# EAGLE design cpc_exp_breakout (EAGLE 9.6.2)
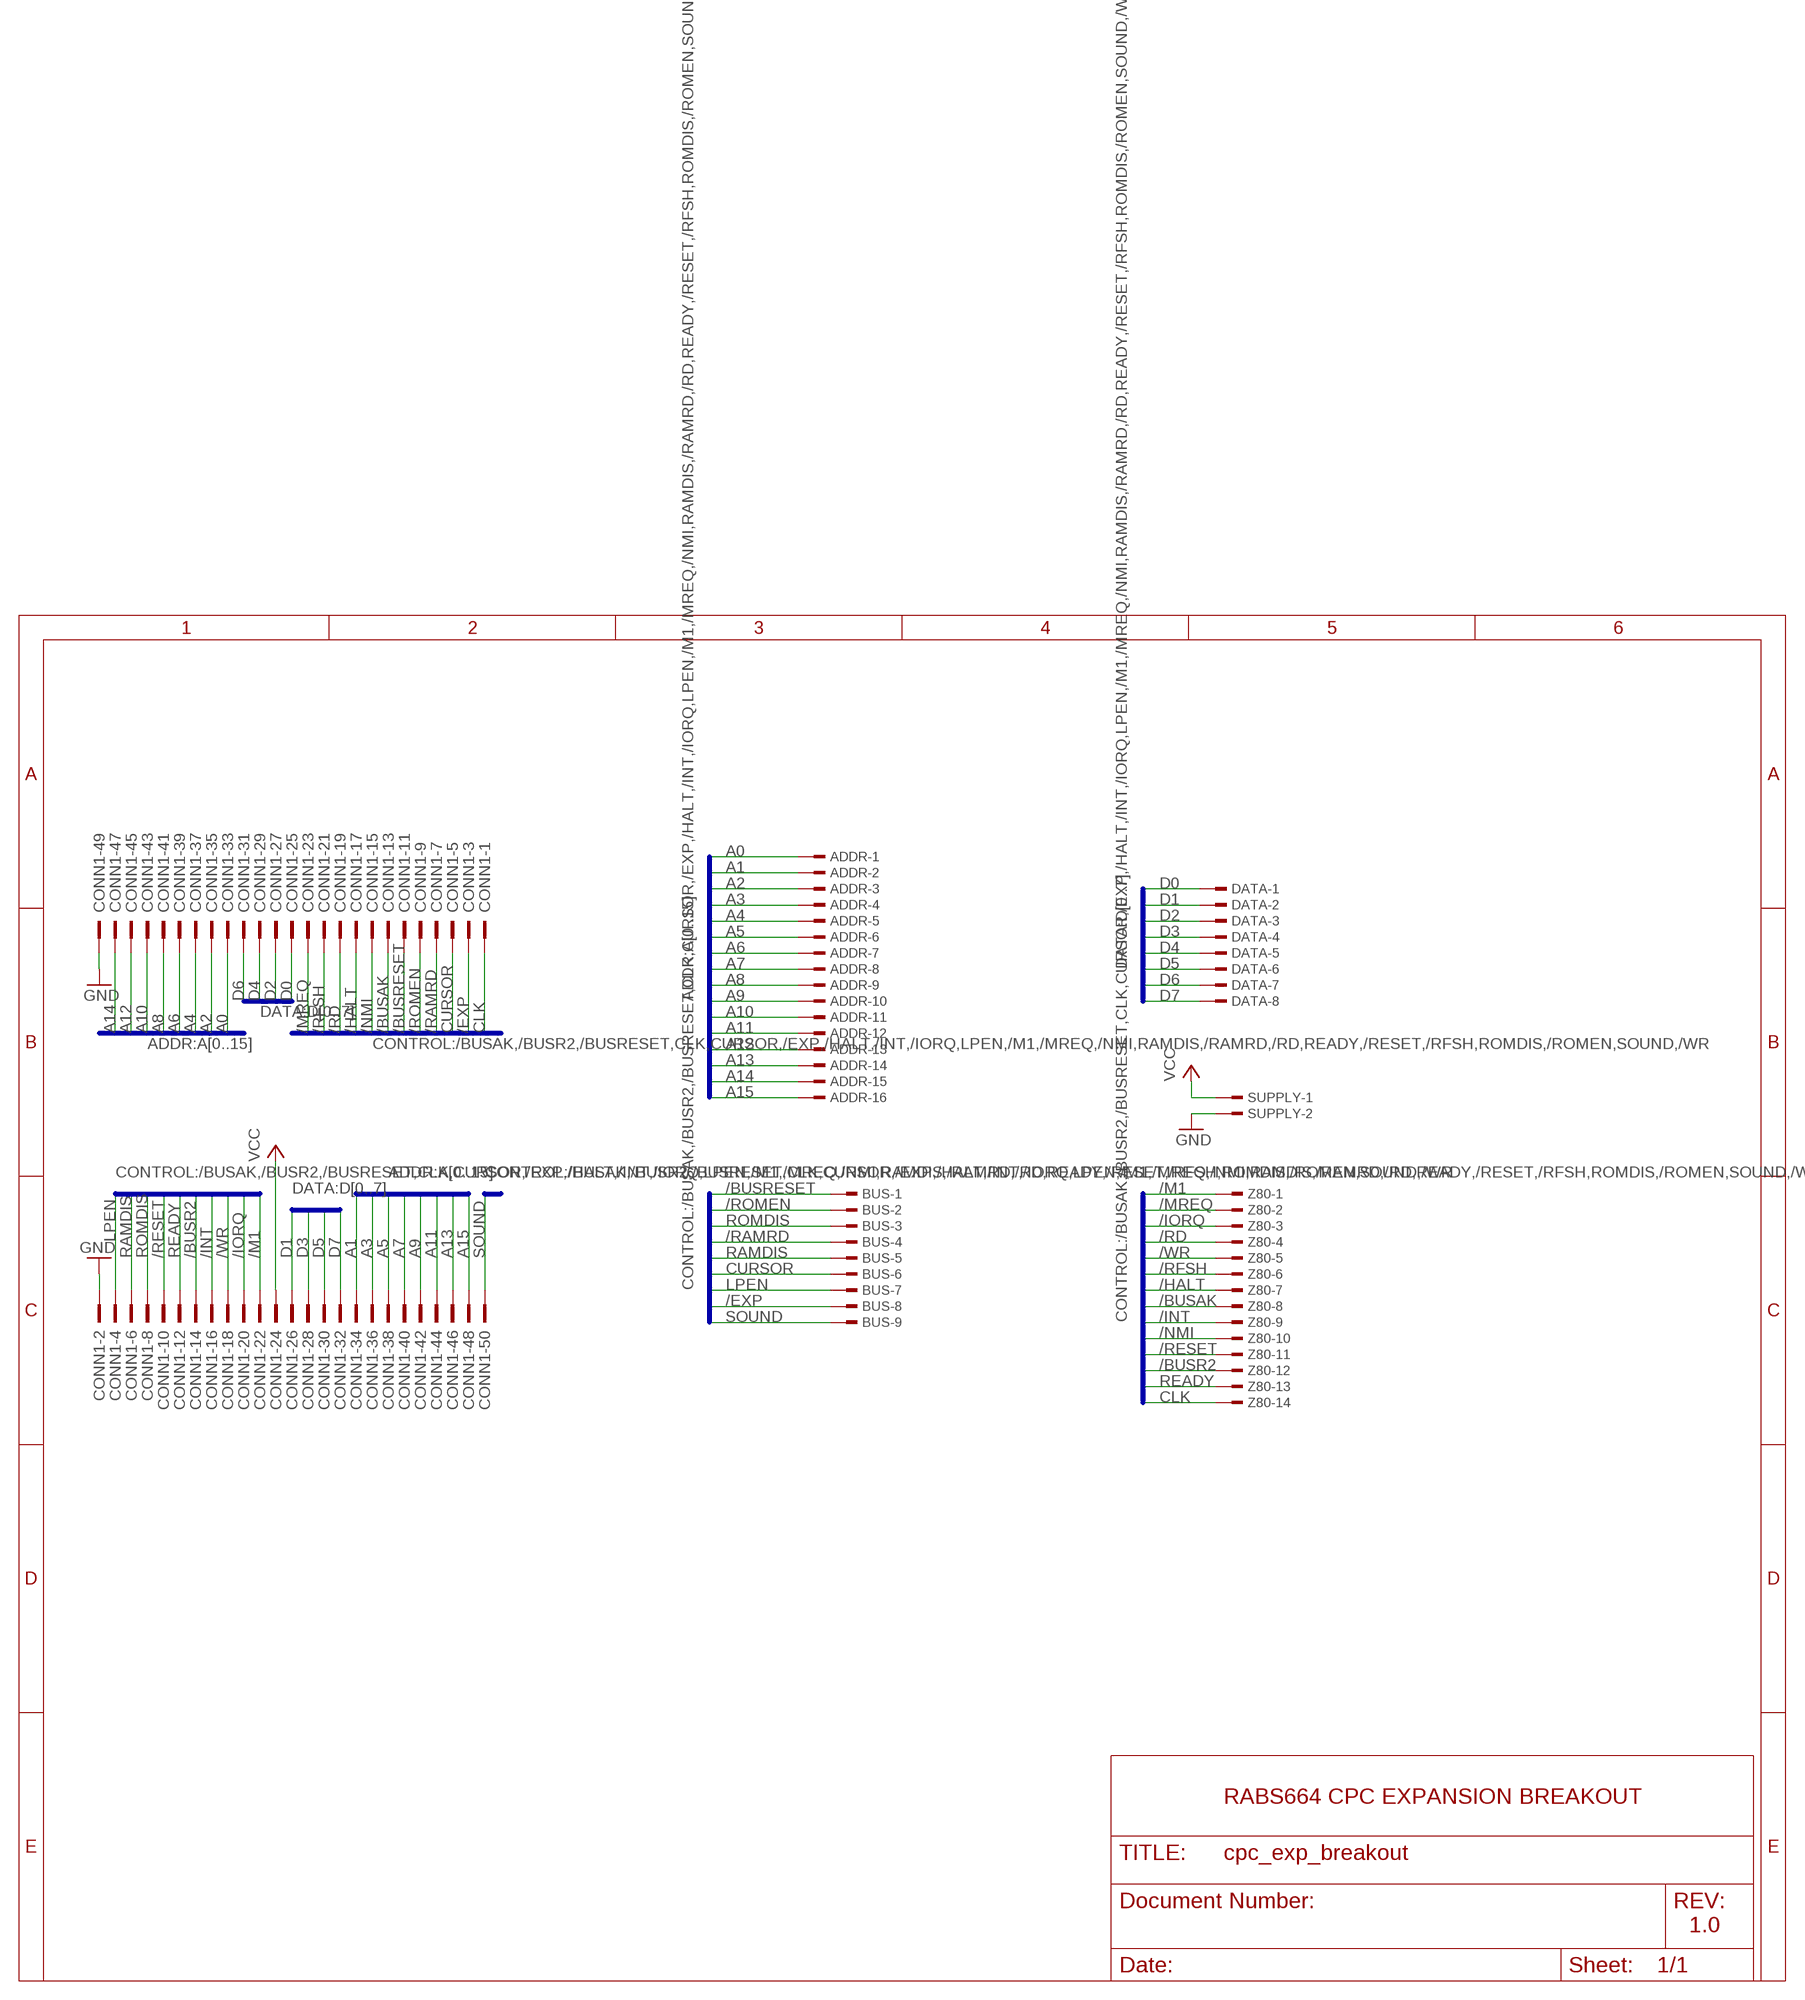
[diagram p0: schematic, sheet 1]

## Parts
ADDR  TSW-116-07-G-S  [TSW-116-XX-G-S]
BUS  TSW-109-07-G-S  [TSW-109-XX-G-S]
CONN1  2550-  [PAK100/2500-50]
DATA  TSW-108-07-G-S  [TSW-108-XX-G-S]
SUPPLY  TSW-102-07-G-S  [TSW-102-XX-G-S]
Z80  TSW-114-07-G-S  [TSW-114-XX-G-S]

## Nets
/BUSAK: CONN1.13 Z80.8
/BUSR2: CONN1.14 Z80.12
/BUSRESET: BUS.1 CONN1.11
/EXP: BUS.8 CONN1.3
/HALT: CONN1.17 Z80.7
/INT: CONN1.16 Z80.9
/IORQ: CONN1.20 Z80.3
/M1: CONN1.22 Z80.1
/MREQ: CONN1.23 Z80.2
/NMI: CONN1.15 Z80.10
/RAMRD: BUS.4 CONN1.7
/RD: CONN1.19 Z80.4
/RESET: CONN1.10 Z80.11
/RFSH: CONN1.21 Z80.6
/ROMEN: BUS.2 CONN1.9
/WR: CONN1.18 Z80.5
A0: ADDR.1 CONN1.33
A1: ADDR.2 CONN1.34
A2: ADDR.3 CONN1.35
A3: ADDR.4 CONN1.36
A4: ADDR.5 CONN1.37
A5: ADDR.6 CONN1.38
A6: ADDR.7 CONN1.39
A7: ADDR.8 CONN1.40
A8: ADDR.9 CONN1.41
A9: ADDR.10 CONN1.42
A10: ADDR.11 CONN1.43
A11: ADDR.12 CONN1.44
A12: ADDR.13 CONN1.45
A13: ADDR.14 CONN1.46
A14: ADDR.15 CONN1.47
A15: ADDR.16 CONN1.48
CLK: CONN1.1 Z80.14
CURSOR: BUS.6 CONN1.5
D0: CONN1.25 DATA.1
D1: CONN1.26 DATA.2
D2: CONN1.27 DATA.3
D3: CONN1.28 DATA.4
D4: CONN1.29 DATA.5
D5: CONN1.30 DATA.6
D6: CONN1.31 DATA.7
D7: CONN1.32 DATA.8
GND [supply]: CONN1.2 CONN1.49 SUPPLY.2
LPEN: BUS.7 CONN1.4
RAMDIS: BUS.5 CONN1.6
READY: CONN1.12 Z80.13
ROMDIS: BUS.3 CONN1.8
SOUND: BUS.9 CONN1.50
VCC [supply]: CONN1.24 SUPPLY.1

## Buses
ADDR:A[0..15]
DATA:D[0..7]
CONTROL:/BUSAK,/BUSR2,/BUSRESET,CLK,CURSOR,/EXP,/HALT,/INT,/IORQ,LPEN,/M1,/MREQ,/NMI,RAMDIS,/RAMRD,/RD,READY,/RESET,/RFSH,ROMDIS,/ROMEN,SOUND,/WR

## Notes on the sheet
- RABS664 CPC EXPANSION BREAKOUT
- 1.0

## Library data of the parts
ADDR = con-samtec:TSW-116-*-G-S: THROUGH-HOLE .025" SQ POST HEADER Source: Samtec TSW.pdf; MF: Samtec Inc.; MPN: TSW-116-07-G-S
BUS = con-samtec:TSW-109-*-G-S: THROUGH-HOLE .025" SQ POST HEADER Source: Samtec TSW.pdf; MF: Samtec Inc.; MPN: TSW-109-07-G-S
CONN1 = con-3m:2550-: 3M (TM) Pak 100 4-Wall Header Source: 3M; OC_FARNELL: unknown; OC_NEWARK: unknown; SPICEPREFIX: X
DATA = con-samtec:TSW-108-*-G-S: THROUGH-HOLE .025" SQ POST HEADER Source: Samtec TSW.pdf; MF: Samtec Inc.; MPN: TSW-108-07-G-S
SUPPLY = con-samtec:TSW-102-*-G-S: THROUGH-HOLE .025" SQ POST HEADER Source: Samtec TSW.pdf; MF: Samtec Inc.; MPN: TSW-102-07-G-S
Z80 = con-samtec:TSW-114-*-G-S: THROUGH-HOLE .025" SQ POST HEADER Source: Samtec TSW.pdf; MF: Samtec Inc.; MPN: TSW-114-07-G-S

## Net classes
0 default: width 0.254 mm, clearance 0.254 mm
1 supply: width 0.508 mm, clearance 0.508 mm

## Board
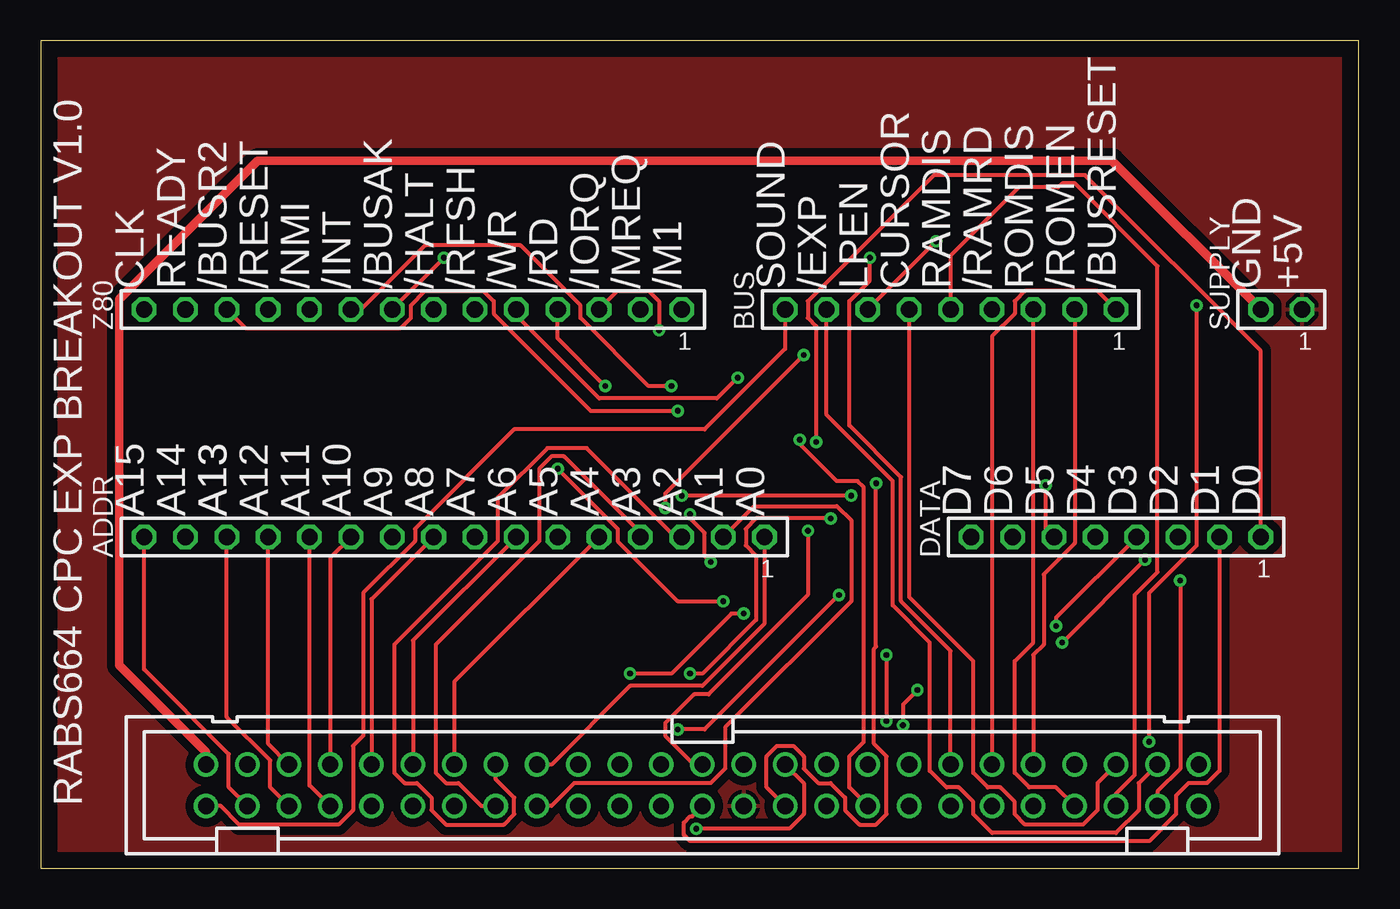
[diagram p1: board, top side]
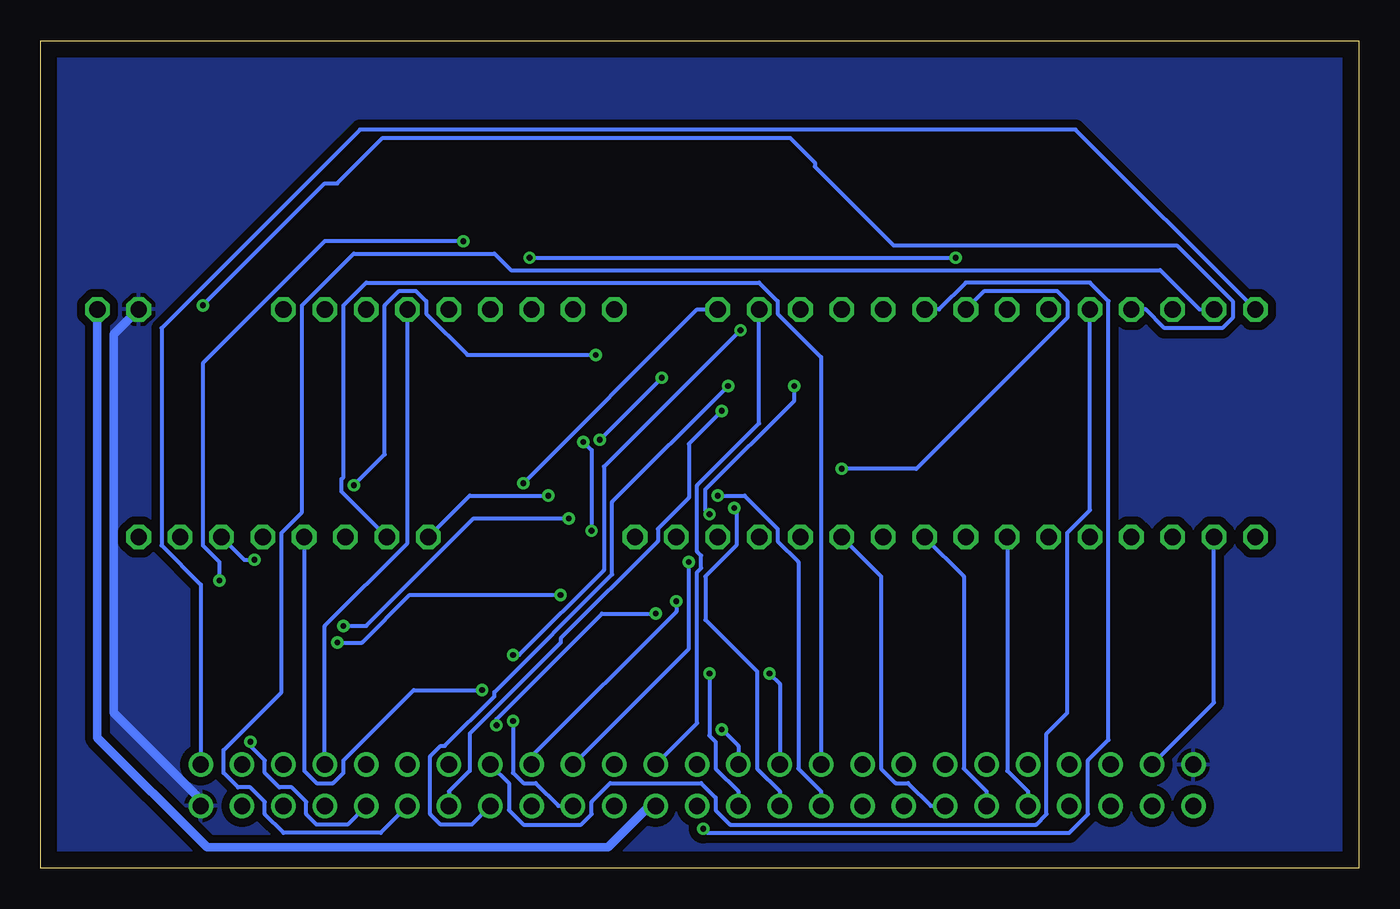
[diagram p2: board, bottom side, seen from below]

Size 80.95 x 50.79 mm. Coordinates in mm from the lower left corner, seen from the top.
Outline: 0,0 80.95,0 80.95,50.79 0,50.79 0,0
Copper layers (1*16): Top 0.035mm / dielectric 1.5mm / Bottom 0.035mm
Design rules "default": minimum track width 6mil, minimum drill 0.35mm, track to track 6mil, track to pad 6mil, pad to pad 6mil, via to via 6mil, smd to smd 6mil, copper to edge 40mil, drill to drill 6mil, minimum pad ring 10mil, minimum via ring 8mil, stop-mask expansion 4mil, vias tented up to drill 0mil, thermal gap 10mil

### Footprints (pad centres in the part's own frame; a part is rotated, then mirrored left to right if it is on the bottom)
TSW-116-XX-G-S = drill 1 pad 1.5 octagon: 1 19.05,0; 2 16.51,0; 3 13.97,0; 4 11.43,0; 5 8.89,0; 6 6.35,0; 7 3.81,0; 8 1.27,0; 9 -1.27,0; 10 -3.81,0; 11 -6.35,0; 12 -8.89,0; 13 -11.43,0; 14 -13.97,0; 15 -16.51,0; 16 -19.05,0
TSW-109-XX-G-S = drill 1 pad 1.5 octagon: 1 10.16,0; 2 7.62,0; 3 5.08,0; 4 2.54,0; 5 0,0; 6 -2.54,0; 7 -5.08,0; 8 -7.62,0; 9 -10.16,0
PAK100/2500-50 = drill 1 pad 1.422: 1 -30.48,-1.27; 2 -30.48,1.27; 3 -27.94,-1.27; 4 -27.94,1.27; 5 -25.4,-1.27; 6 -25.4,1.27; 7 -22.86,-1.27; 8 -22.86,1.27; 9 -20.32,-1.27; 10 -20.32,1.27; 11 -17.78,-1.27; 12 -17.78,1.27; 13 -15.24,-1.27; 14 -15.24,1.27; 15 -12.7,-1.27; 16 -12.7,1.27; 17 -10.16,-1.27; 18 -10.16,1.27; 19 -7.62,-1.27; 20 -7.62,1.27; 21 -5.08,-1.27; 22 -5.08,1.27; 23 -2.54,-1.27; 24 -2.54,1.27; 25 0,-1.27; 26 0,1.27; 27 2.54,-1.27; 28 2.54,1.27; 29 5.08,-1.27; 30 5.08,1.27; 31 7.62,-1.27; 32 7.62,1.27; 33 10.16,-1.27; 34 10.16,1.27; 35 12.7,-1.27; 36 12.7,1.27; 37 15.24,-1.27; 38 15.24,1.27; 39 17.78,-1.27; 40 17.78,1.27; 41 20.32,-1.27; 42 20.32,1.27; 43 22.86,-1.27; 44 22.86,1.27; 45 25.4,-1.27; 46 25.4,1.27; 47 27.94,-1.27; 48 27.94,1.27; 49 30.48,-1.27; 50 30.48,1.27
TSW-108-XX-G-S = drill 1 pad 1.5 octagon: 1 8.89,0; 2 6.35,0; 3 3.81,0; 4 1.27,0; 5 -1.27,0; 6 -3.81,0; 7 -6.35,0; 8 -8.89,0
TSW-102-XX-G-S = drill 1 pad 1.5 octagon: 1 1.27,0; 2 -1.27,0
TSW-114-XX-G-S = drill 1 pad 1.5 octagon: 1 16.51,0; 2 13.97,0; 3 11.43,0; 4 8.89,0; 5 6.35,0; 6 3.81,0; 7 1.27,0; 8 -1.27,0; 9 -3.81,0; 10 -6.35,0; 11 -8.89,0; 12 -11.43,0; 13 -13.97,0; 14 -16.51,0

### Placement (x,y rotation side)
ADDR  25.4,20.32 0 top
BUS  55.88,34.29 0 top
CONN1  40.64,5.08 180 top
DATA  66.04,20.32 0 top
SUPPLY  76.2,34.29 0 top
Z80  22.86,34.29 0 top

### Tracks (layer width: path | path; a pad name or v marks a point on that pad's centre or on a via)
/BUSAK  (via drill 0.35)
  Top 0.254: v24.77,37.47 Z80.8 | v50.93,37.47 50.93,36.07 49.66,34.8 49.66,27.18 52.83,24 52.83,16.38 55.88,13.34 CONN1.13
  Bottom 0.254: v50.93,37.47 v24.77,37.47
/BUSR2  (via drill 0.35)
  Top 0.254: v39.12,28.07 33.78,28.07 27.81,34.04 27.81,34.8 27.18,35.43 23.62,35.43 22.73,34.54 22.73,33.78 22.1,33.15 12.57,33.15 Z80.12
  Bottom 0.254: CONN1.14 55.88,4.7 54.61,5.97 54.61,8.26 49.02,13.84 49.02,14.1 43.05,20.07 43.05,20.83 41.15,22.73 41.15,26.04 v39.12,28.07
/BUSRESET
  Top 0.254: CONN1.11 58.42,32.64 59.82,34.04 59.82,34.8 60.45,35.43 64.9,35.43 BUS.1
/EXP
  Top 0.254: BUS.8 48.26,27.81 52.32,23.75 52.32,16.13 54.61,13.84 54.61,5.97 55.63,4.95 56.39,4.95 57.28,4.06 57.28,3.3 58.42,2.16 66.04,2.16 67.44,3.56 67.44,5.21 CONN1.3
/HALT  (via drill 0.35)
  Top 0.254: v41.91,16.38 39.12,16.38 35.43,20.07 35.43,20.83 v31.75,24.51
  Bottom 0.254: CONN1.17 50.8,6.86 41.91,15.75 v41.91,16.38 | v31.75,24.51 27.18,24.51 17.91,33.78 17.91,34.8 18.54,35.43 22.99,35.43 Z80.7
/INT  (via drill 0.35)
  Top 0.254: Z80.9 19.68,34.29 23.62,38.23 29.46,38.23 33.15,34.54 33.15,33.78 37.34,29.59 v38.73,29.59
  Bottom 0.254: v38.73,29.59 45.85,22.48 45.85,18.03 53.09,10.79 53.09,10.54 56.13,7.49 56.39,7.49 57.02,6.86 57.02,3.3 56.39,2.67 54.48,2.67 CONN1.16
/IORQ  (via drill 0.35)
  Top 0.254: v51.94,13.08 v51.94,9.02 | v37.97,33.02 37.97,34.8 37.34,35.43 35.43,35.43 Z80.3
  Bottom 0.254: CONN1.20 49.15,3.81 50.55,5.21 51.31,5.21 51.94,5.84 v51.94,9.02 | v51.94,13.08 51.56,13.08 46.35,18.29 46.35,24.64 v37.97,33.02
/M1  (via drill 0.35)
  Top 0.254: v51.31,23.62 51.31,13.59 51.18,13.46 51.18,7.62 51.94,6.86 51.94,3.3 51.31,2.67 50.29,2.67 49.4,3.56 49.4,4.32 48.51,5.21 47.75,5.21 46.86,6.1 46.86,6.86 46.23,7.49 45.21,7.49 44.58,6.86 44.58,4.95 CONN1.22
  Bottom 0.254: Z80.1 40.64,34.29 v51.31,23.62
/MREQ
  Bottom 0.254: Z80.2 36.83,27.3 40.64,23.5 40.64,19.43 40.39,19.18 40.39,18.41 40.64,18.16 40.64,8.89 CONN1.23
/NMI
  Bottom 0.254: Z80.10 16.51,21.97 17.91,20.57 17.91,9.53 19.18,8.26 19.18,3.3 19.81,2.67 38.61,2.67 39.5,3.56 39.5,4.32 40.39,5.21 45.97,5.21 47.12,4.06 47.12,3.3 47.75,2.67 51.31,2.67 52.2,3.56 52.2,5.21 CONN1.15
/RAMRD
  Bottom 0.254: BUS.4 58.42,19.94 63.5,14.86 CONN1.7
/RD  (via drill 0.35)
  Top 0.254: Z80.4 31.75,32.51 v34.67,29.59 | v39.88,21.72 39.88,21.46 40.77,20.57 40.77,19.18 v41.15,18.8
  Bottom 0.254: v34.67,29.59 34.67,28.7 40.13,23.24 40.13,21.97 v39.88,21.72 | v41.15,18.8 41.15,13.46 CONN1.19
/RESET  (via drill 0.35)
  Top 0.254: v70.99,34.54 70.99,19.81 68.07,16.89 v68.07,7.75
  Bottom 0.254: Z80.11 13.08,34.29 11.94,33.15 8.38,33.15 7.75,33.78 7.75,34.8 11.18,38.23 28.57,38.23 33.4,43.05 33.4,43.31 34.92,44.83 59.94,44.83 62.74,42.04 63.5,42.04 v70.99,34.54 | v68.07,7.75 68.07,7.49 67.18,6.6 67.18,5.84 66.29,4.95 65.53,4.95 64.64,4.06 64.64,3.3 64.01,2.67 62.1,2.67 CONN1.10
/RFSH  (via drill 0.35)
  Top 0.254: v40.26,2.41 45.97,2.41 46.86,3.3 46.86,5.21 CONN1.21
  Bottom 0.254: Z80.6 25.78,34.29 24.13,35.94 16.51,35.94 15.37,34.8 15.37,7.87 16.64,6.6 16.64,3.3 17.78,2.16 40.01,2.16 v40.26,2.41
/ROMEN
  Top 0.254: CONN1.9 60.96,13.08 61.59,13.72 61.59,18.03 63.5,19.94 BUS.2
/WR  (via drill 0.35)
  Top 0.254: Z80.5 29.21,33.91 34.29,28.83 41.53,28.83 v42.8,30.1 | v46.61,26.29 46.61,26.04 48.9,23.75 50.16,23.75 50.55,23.37 50.55,7.75 49.66,6.86 49.66,4.95 CONN1.18
  Bottom 0.254: v46.61,26.29 v42.8,30.1
A0
  Top 0.254: CONN1.33 31.37,6.35 36.2,11.18 40.64,11.18 44.45,14.99 ADDR.1
A1
  Top 0.254: CONN1.34 31.37,3.81 32.77,5.21 41.15,5.21 42.04,6.1 42.04,8.64 49.78,16.38 49.78,21.34 48.9,22.23 43.81,22.23 ADDR.2
A2
  Top 0.254: CONN1.35 27.94,5.46 29.08,4.32 29.08,3.3 28.45,2.67 24.89,2.67 24,3.56 24,4.32 23.11,5.21 22.35,5.21 21.72,5.84 21.72,13.72 28.07,20.07 28.07,22.73 31.11,25.78 33.53,25.78 38.99,20.32 ADDR.3
A3
  Top 0.254: CONN1.36 27.05,3.81 25.65,5.21 24.89,5.21 24.26,5.84 24.26,13.72 30.61,20.07 30.61,24.51 31.37,25.27 32.13,25.27 36.83,20.57 ADDR.4
A4
  Top 0.254: CONN1.37 25.4,11.43 ADDR.5
A5
  Bottom 0.254: CONN1.38 26.29,3.81 27.69,5.21 28.45,5.21 29.34,6.1 29.34,17.91 ADDR.6
A6
  Top 0.254: CONN1.39 22.86,13.97 ADDR.7
A7
  Bottom 0.254: CONN1.40 22.86,4.7 24.26,6.1 24.26,17.91 ADDR.8
A8
  Top 0.254: CONN1.41 20.32,16.51 ADDR.9
A9
  Bottom 0.254: CONN1.42 20.32,4.7 21.59,5.97 ADDR.10
A10
  Top 0.254: CONN1.43 17.78,19.05 ADDR.11
A11
  Top 0.254: ADDR.12 16.51,5.08 CONN1.44
A12
  Top 0.254: ADDR.13 13.97,7.62 CONN1.45
A13
  Top 0.254: ADDR.14 11.43,9.27 14.1,6.6 14.1,4.95 CONN1.46
A14
  Bottom 0.254: ADDR.15 8.89,10.16 CONN1.47
A15
  Top 0.254: ADDR.16 6.35,12.19 11.56,6.99 11.56,4.95 CONN1.48
CLK
  Bottom 0.254: CONN1.1 71.12,17.4 73.53,19.81 73.53,33.15 61.34,45.34 17.4,45.34 Z80.14
CURSOR
  Top 0.254: BUS.6 53.34,16.64 57.28,12.7 57.28,5.84 58.17,4.95 58.93,4.95 59.82,4.06 59.82,3.3 60.45,2.67 64.01,2.67 64.9,3.56 64.9,5.21 CONN1.5
D0  (via drill 0.35)
  Top 0.254: CONN1.25 40.13,6.35 38.35,8.13 38.35,8.89 40.13,10.67 41.02,10.67 47.12,16.76 v47.12,20.7 | v47.62,26.16 47.62,33.27 47.12,33.78 47.12,34.8 54.86,42.55 64.14,42.55 74.93,31.75 DATA.1
  Bottom 0.254: v47.12,20.7 47.12,25.65 v47.62,26.16
D1
  Top 0.254: CONN1.26 40.01,3.17 39.88,3.17 39.5,2.79 39.5,2.03 39.88,1.65 68.07,1.65 69.72,3.3 69.72,4.45 70.48,5.21 71.63,5.21 72.39,5.97 DATA.2
D2  (via drill 0.35)
  Top 0.254: v39.12,8.51 40.77,8.51 v49.02,16.76 | v67.82,18.92 v62.74,13.84
  Bottom 0.254: CONN1.27 38.1,7.49 v39.12,8.51 | v49.02,16.76 58.29,16.76 61.21,13.84 v62.74,13.84 | v67.82,18.92 68.45,18.92 DATA.3
D3  (via drill 0.35)
  Top 0.254: v39.88,11.94 40.64,11.94 43.94,15.24 43.94,19.18 43.31,19.81 43.31,20.83 43.94,21.46 v48.51,21.46 | v62.36,14.86 62.36,15.37 DATA.4
  Bottom 0.254: CONN1.28 38.1,4.7 39.5,6.1 39.5,7.75 39.88,8.13 v39.88,11.94 | v48.51,21.46 54.36,21.46 60.96,14.86 v62.36,14.86
D4  (via drill 0.35)
  Top 0.254: v36.2,11.94 38.73,11.94 42.42,15.62 v43.18,15.62 | v52.96,8.76 52.96,10.03 v53.85,10.92
  Bottom 0.254: CONN1.29 35.56,11.3 v36.2,11.94 | v43.18,15.62 46.48,15.62 52.96,9.14 v52.96,8.76 | v53.85,10.92 58.04,10.92 62.36,6.6 62.36,5.84 62.99,5.21 64.01,5.21 64.77,5.97 DATA.5
D5  (via drill 0.35)
  Top 0.254: v38.35,22.1 38.35,22.99 v46.86,31.5 | v61.72,23.5 61.72,20.83 DATA.6
  Bottom 0.254: CONN1.30 35.56,4.7 36.96,6.1 36.96,12.06 40.13,15.24 40.13,17.91 38.23,19.81 38.23,21.97 v38.35,22.1 | v46.86,31.5 54.74,31.5 57.28,34.04 57.28,34.8 57.91,35.43 58.93,35.43 59.82,34.54 59.82,25.4 v61.72,23.5
D6
  Bottom 0.254: CONN1.31 33.02,31.37 35.69,34.04 35.69,34.8 36.83,35.94 60.96,35.94 62.36,34.54 62.36,24 62.48,23.88 62.48,23.11 DATA.7
D7  (via drill 0.35)
  Top 0.254: v49.78,22.86 v39.37,22.86
  Bottom 0.254: CONN1.32 33.02,4.7 34.42,6.1 34.42,18.8 35.69,20.07 35.69,20.83 37.72,22.86 v39.37,22.86 | v49.78,22.86 54.61,22.86 DATA.8
GND
  Top 0.508: CONN1.49 10.16,7.11 4.83,12.45 4.83,34.92 13.34,43.43 65.79,43.43 SUPPLY.2
  Bottom 0.508: CONN1.2 71.12,4.19 76.45,9.53 76.45,32.77 SUPPLY.2
  pour Bottom: -1.27,52.07 -1.27,-1.27 82.55,-1.27 82.55,52.07
LPEN  (via drill 0.35)
  Top 0.254: CONN1.4 68.58,4.7 69.98,6.1 v69.98,17.65 | BUS.7 v54.99,38.48
  Bottom 0.254: v69.98,17.65 69.98,18.8 70.99,19.81 70.99,30.99 63.5,38.48 v54.99,38.48
RAMDIS
  Top 0.254: BUS.5 55.88,37.59 60.07,41.78 62.48,41.78 62.74,42.04 63.5,42.04 68.58,36.96 68.58,18.16 67.18,16.76 67.18,5.71 66.04,4.57 CONN1.6
READY
  Bottom 0.254: Z80.13 9.78,34.29 12.19,36.7 52.07,36.7 53.09,37.72 61.72,37.72 64.9,34.54 64.9,21.84 66.17,20.57 66.17,10.79 69.72,7.24 69.72,5.84 68.83,4.95 68.07,4.95 67.18,4.06 67.18,3.3 66.04,2.16 60.07,2.16 CONN1.12
ROMDIS
  Top 0.254: BUS.3 60.96,13.84 59.82,12.7 59.82,5.84 60.71,4.95 62.36,4.95 CONN1.8
SOUND
  Top 0.254: CONN1.50 11.05,3.81 12.19,2.67 18.29,2.67 19.18,3.56 19.18,7.49 19.81,8.13 19.81,16.89 22.99,20.07 22.99,20.83 29.08,26.92 40.77,26.92 45.72,31.88 BUS.9
VCC
  Bottom 0.508: CONN1.24 43.56,3.81 46.1,1.27 70.74,1.27 77.47,8 SUPPLY.1
  pour Top: -1.27,52.07 -1.27,-1.27 82.55,-1.27 82.55,52.07

### Text on the board
tNames: CLK | READY | /BUSR2 | /RESET | /NMI | /INT | /BUSAK | /HALT | /RFSH | /WR | /RD | /IORQ | /MREQ | /M1 | SOUND | /EXP | LPEN | CURSOR | RAMDIS | /RAMRD | ROMDIS | /ROMEN | /BUSRESET | GND | +5V | A15 | A14 | A13 | A13 | A12 | A11 | A10 | A9 | A8 | A7 | A6 | A5 | A4 | A3 | A2 | A1 | A0 | D7 | D7 | D6 | D5 | D4 | D3 | D2 | D1 | D0 | RABS664 CPC EXP BREAKOUT V1.0